# EAGLE design POWER_DISTRO_PiFilter (EAGLE 5.06)
SHT_NAME: POWER INPUT; VOLTAGE: 36V

## Sheet 1 of 4
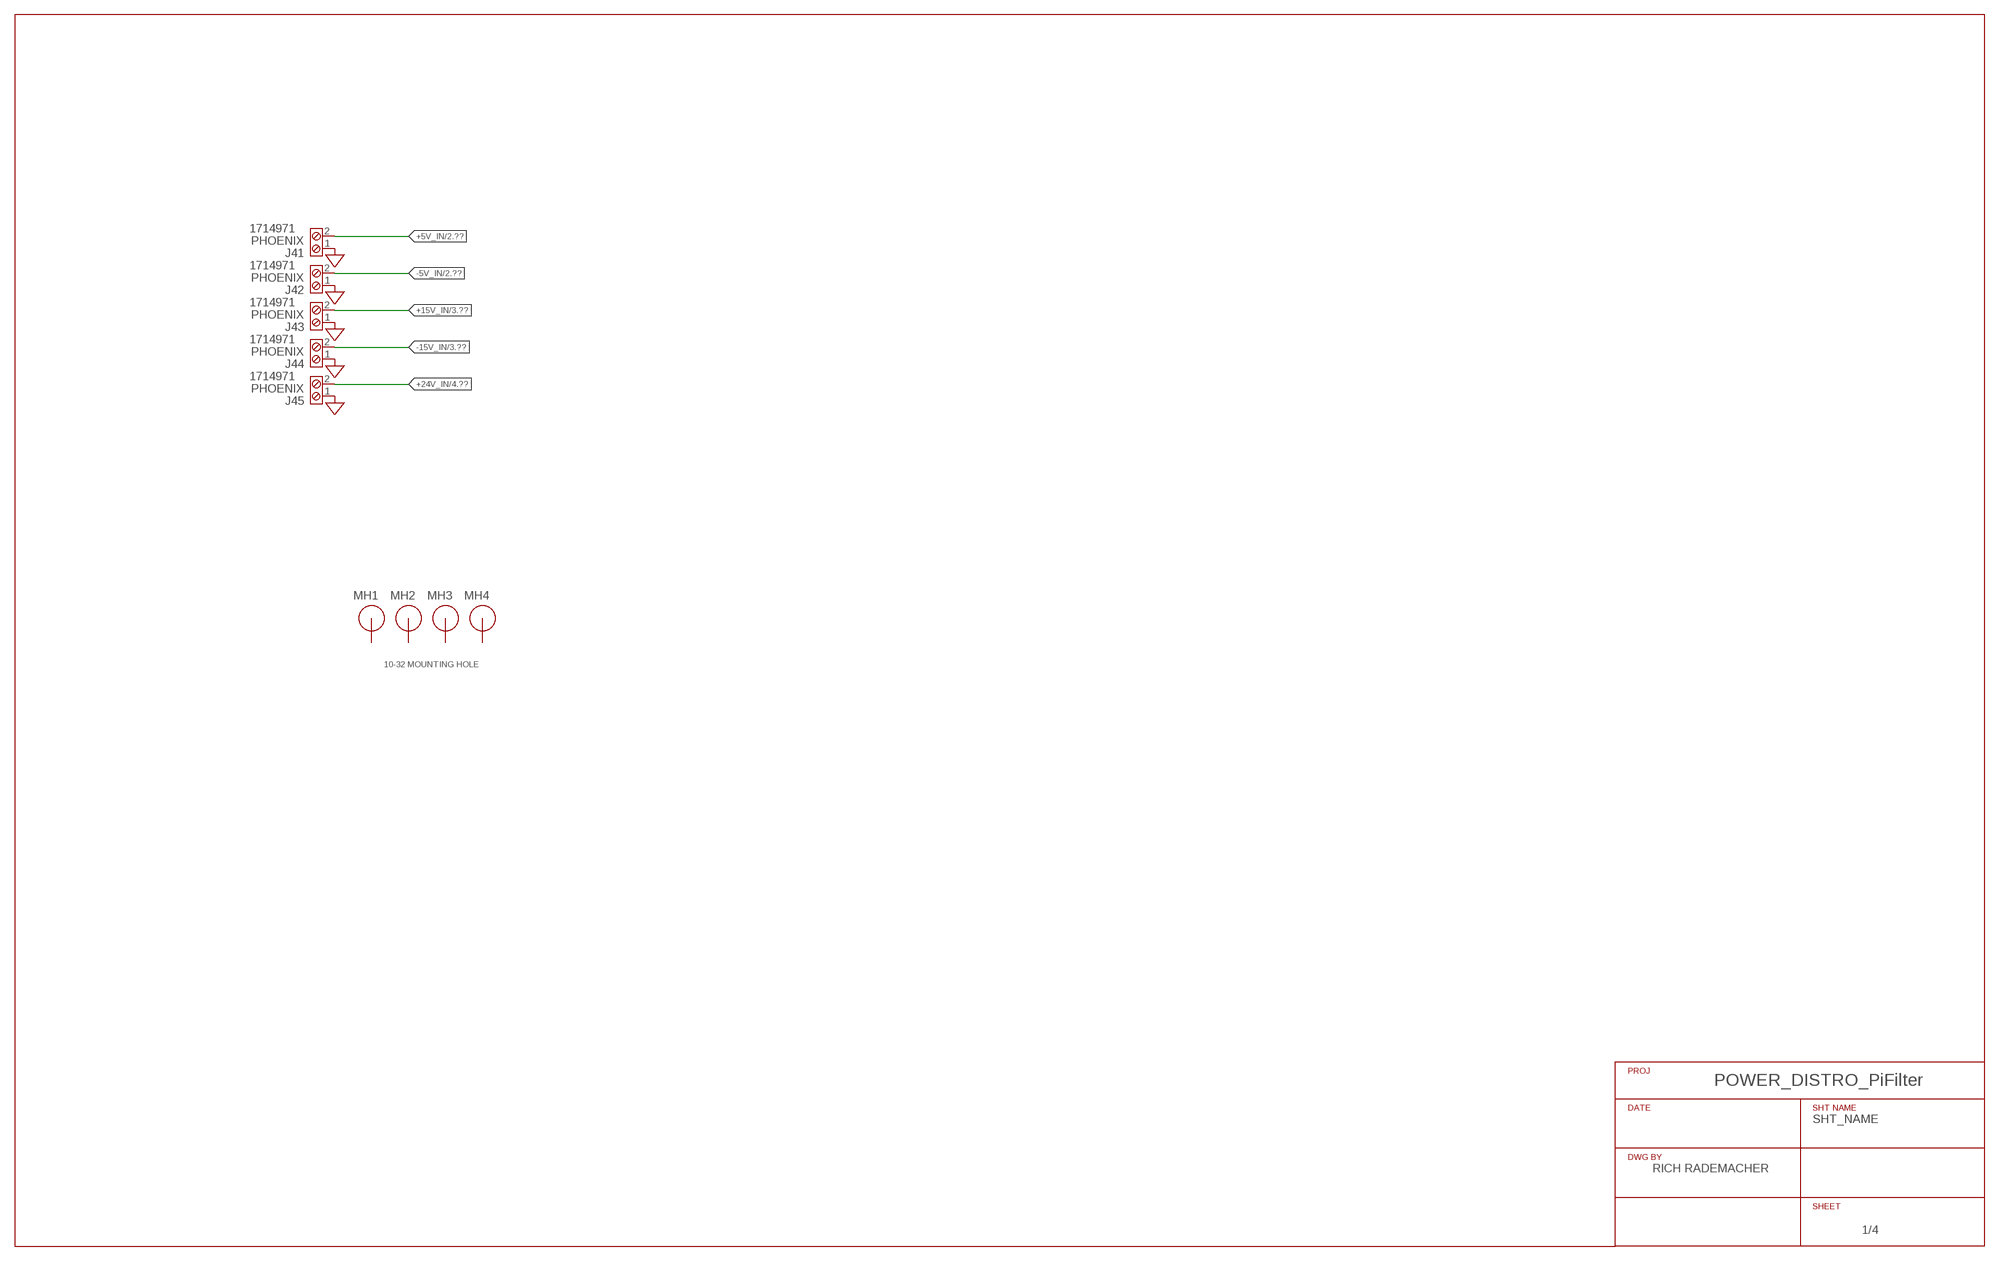
[diagram p0: schematic, sheet 1]
U$4 (TITLEBLOCK): AUTHOR: RICH RADEMACHER; DO_NOT_BOM: TRUE; SHT_NAME: SHT_NAME

### Parts
J41  CONN_SCREWTERM_9.52MM_2POS  [PHOENIX_SCREWTERM_9.52MM_2POS]
J42  CONN_SCREWTERM_9.52MM_2POS  [PHOENIX_SCREWTERM_9.52MM_2POS]
J43  CONN_SCREWTERM_9.52MM_2POS  [PHOENIX_SCREWTERM_9.52MM_2POS]
J44  CONN_SCREWTERM_9.52MM_2POS  [PHOENIX_SCREWTERM_9.52MM_2POS]
J45  CONN_SCREWTERM_9.52MM_2POS  [PHOENIX_SCREWTERM_9.52MM_2POS]
MH1  MTG-HOLE-10-32  [MTG-10-32]
MH2  MTG-HOLE-10-32  [MTG-10-32]
MH3  MTG-HOLE-10-32  [MTG-10-32]
MH4  MTG-HOLE-10-32  [MTG-10-32]

### Nets
+5V_IN: J41.2 ; also sheet 2
+15V_IN: J43.2 ; also sheet 3
+24V_IN: J45.2 ; also sheet 4
-5V_IN: J42.2 ; also sheet 2
-15V_IN: J44.2 ; also sheet 3
AGND: J41.1 J42.1 J43.1 J44.1 J45.1 ; also sheet 2,3,4
Unconnected: MH1.1 MH2.1 MH3.1 MH4.1

### Notes on the sheet
- 10-32 MOUNTING HOLE

## Sheet 2 of 4
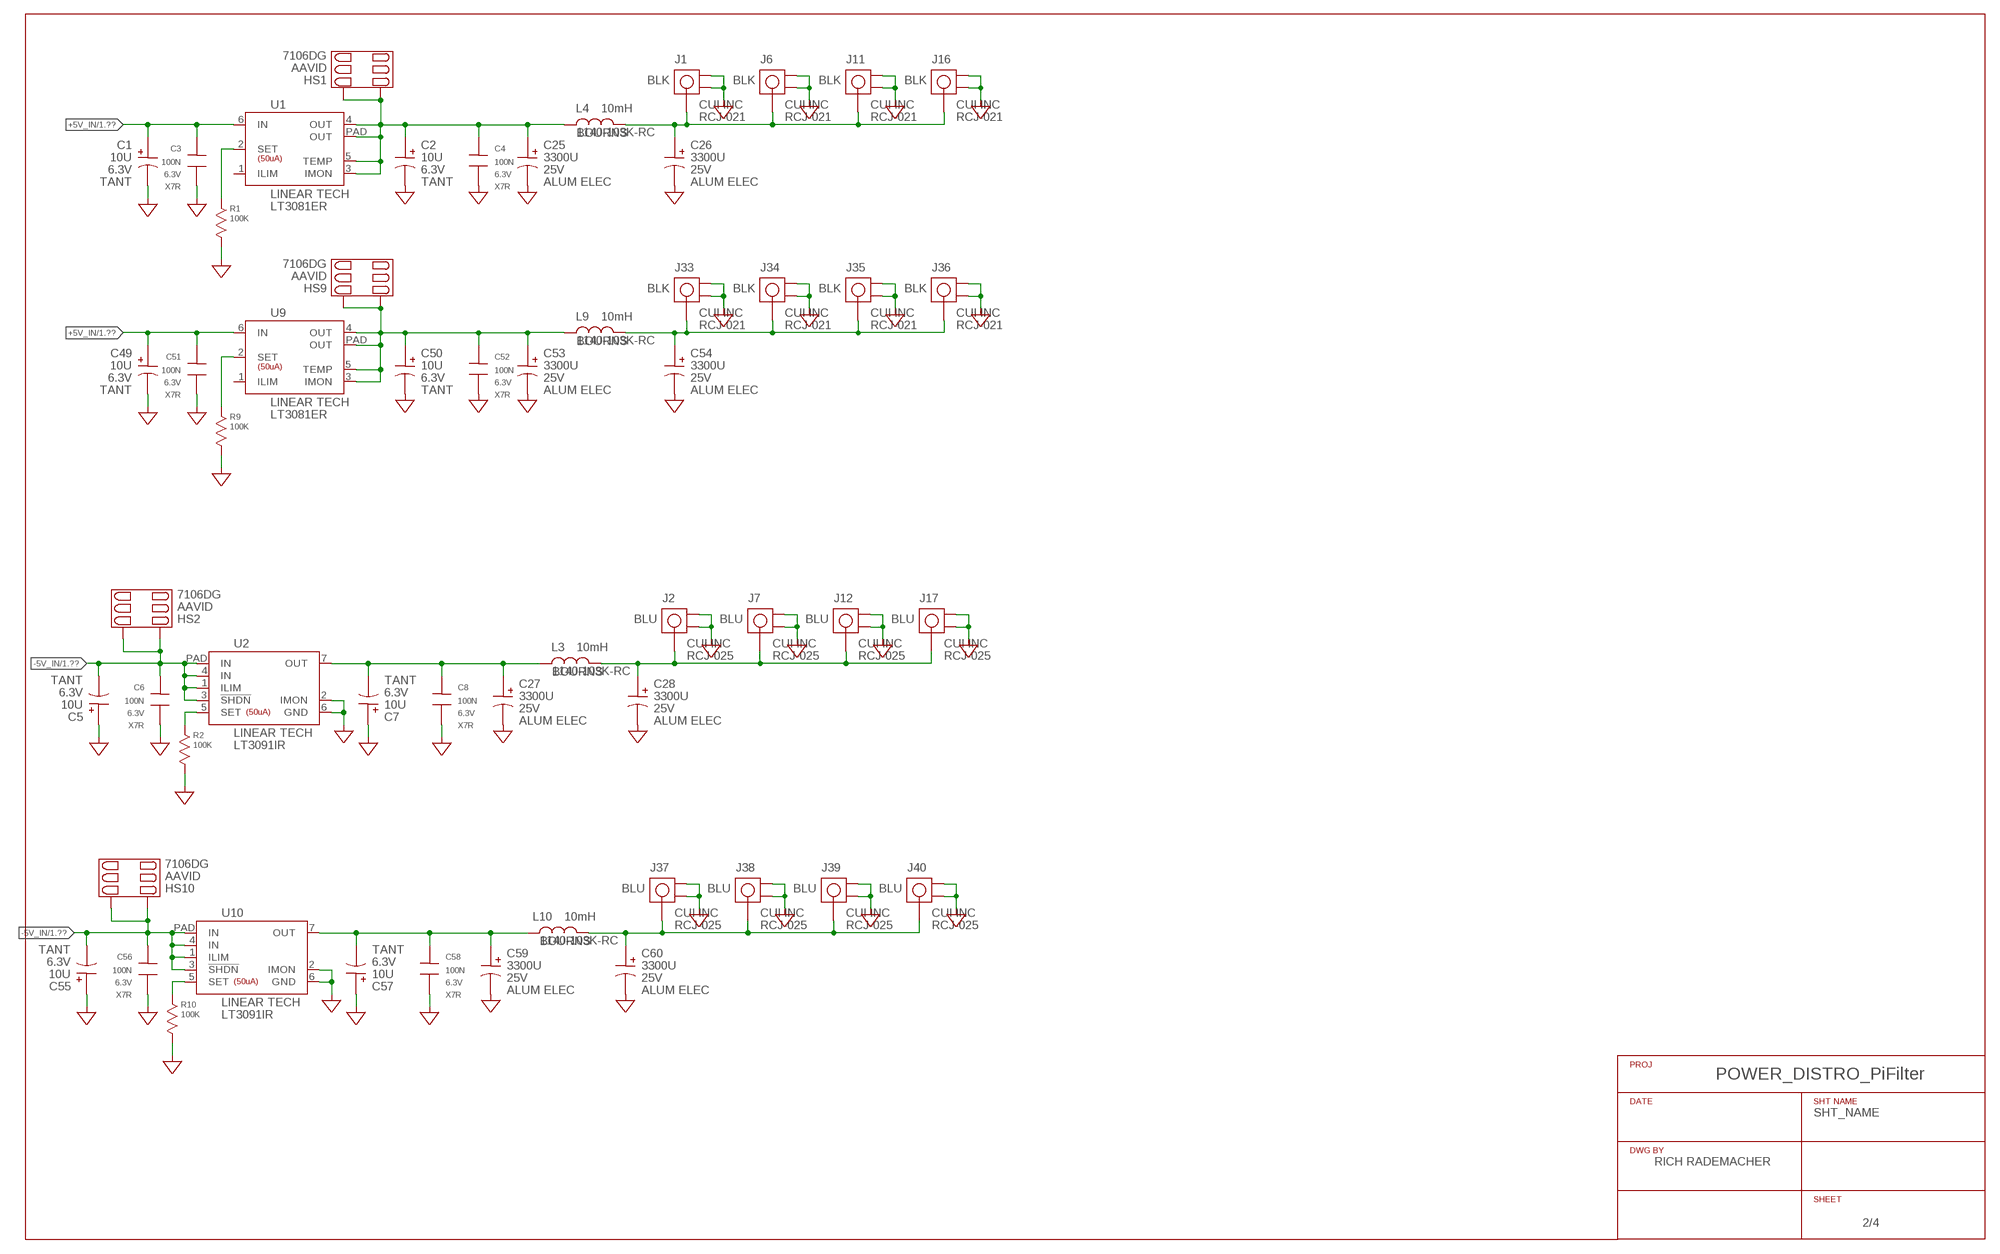
[diagram p1: schematic, sheet 2]
U$1 (TITLEBLOCK): AUTHOR: RICH RADEMACHER; DO_NOT_BOM: TRUE; SHT_NAME: SHT_NAME

### Parts
C1  10U  CAP-POL-SIZED  [CAP-SIZE_D/E_EIA7343]
C2  10U  CAP-POL-SIZED  [CAP-SIZE_D/E_EIA7343]
C3  100N  CAP-NP-0805  [R-0805]
C4  100N  CAP-NP-0805  [R-0805]
C5  10U  CAP-POL-SIZED  [CAP-SIZE_D/E_EIA7343]
C6  100N  CAP-NP-0805  [R-0805]
C7  10U  CAP-POL-SIZED  [CAP-SIZE_D/E_EIA7343]
C8  100N  CAP-NP-0805  [R-0805]
C25  3300U  CAP-POL-18MMDIAM  [CAP-18MM_SMT]
C26  3300U  CAP-POL-18MMDIAM  [CAP-18MM_SMT]
C27  3300U  CAP-POL-18MMDIAM  [CAP-18MM_SMT]
C28  3300U  CAP-POL-18MMDIAM  [CAP-18MM_SMT]
C49  10U  CAP-POL-SIZED  [CAP-SIZE_D/E_EIA7343]
C50  10U  CAP-POL-SIZED  [CAP-SIZE_D/E_EIA7343]
C51  100N  CAP-NP-0805  [R-0805]
C52  100N  CAP-NP-0805  [R-0805]
C53  3300U  CAP-POL-18MMDIAM  [CAP-18MM_SMT]
C54  3300U  CAP-POL-18MMDIAM  [CAP-18MM_SMT]
C55  10U  CAP-POL-SIZED  [CAP-SIZE_D/E_EIA7343]
C56  100N  CAP-NP-0805  [R-0805]
C57  10U  CAP-POL-SIZED  [CAP-SIZE_D/E_EIA7343]
C58  100N  CAP-NP-0805  [R-0805]
C59  3300U  CAP-POL-18MMDIAM  [CAP-18MM_SMT]
C60  3300U  CAP-POL-18MMDIAM  [CAP-18MM_SMT]
HS1  HEATSINK_AAVID_7106  [AAVID_7106]
HS2  HEATSINK_AAVID_7106  [AAVID_7106]
HS9  HEATSINK_AAVID_7106  [AAVID_7106]
HS10  HEATSINK_AAVID_7106  [AAVID_7106]
J1  CONN_RCA  CONN_RCA-BLACK-BLK  [CUI_RCJ-02X]
J2  CONN_RCA  CONN_RCA-BLU-BLK  [CUI_RCJ-02X]
J6  CONN_RCA  CONN_RCA-BLACK-BLK  [CUI_RCJ-02X]
J7  CONN_RCA  CONN_RCA-BLU-BLK  [CUI_RCJ-02X]
J11  CONN_RCA  CONN_RCA-BLACK-BLK  [CUI_RCJ-02X]
J12  CONN_RCA  CONN_RCA-BLU-BLK  [CUI_RCJ-02X]
J16  CONN_RCA  CONN_RCA-BLACK-BLK  [CUI_RCJ-02X]
J17  CONN_RCA  CONN_RCA-BLU-BLK  [CUI_RCJ-02X]
J33  CONN_RCA  CONN_RCA-BLACK-BLK  [CUI_RCJ-02X]
J34  CONN_RCA  CONN_RCA-BLACK-BLK  [CUI_RCJ-02X]
J35  CONN_RCA  CONN_RCA-BLACK-BLK  [CUI_RCJ-02X]
J36  CONN_RCA  CONN_RCA-BLACK-BLK  [CUI_RCJ-02X]
J37  CONN_RCA  CONN_RCA-BLU-BLK  [CUI_RCJ-02X]
J38  CONN_RCA  CONN_RCA-BLU-BLK  [CUI_RCJ-02X]
J39  CONN_RCA  CONN_RCA-BLU-BLK  [CUI_RCJ-02X]
J40  CONN_RCA  CONN_RCA-BLU-BLK  [CUI_RCJ-02X]
L3  10mH  INDUCTOR-BOURNS1040  [BOURNS_1040_INDUCTOR]
L4  10mH  INDUCTOR-BOURNS1040  [BOURNS_1040_INDUCTOR]
L9  10mH  INDUCTOR-BOURNS1040  [BOURNS_1040_INDUCTOR]
L10  10mH  INDUCTOR-BOURNS1040  [BOURNS_1040_INDUCTOR]
R1  100K  RESISTOR-0805  [R-0805]
R2  100K  RESISTOR-0805  [R-0805]
R9  100K  RESISTOR-0805  [R-0805]
R10  100K  RESISTOR-0805  [R-0805]
U1  REG_LT3081  [DD-7_LINEARTECH]
U2  REG_LT3091  [DD-7_LINEARTECH]
U9  REG_LT3081  [DD-7_LINEARTECH]
U10  REG_LT3091  [DD-7_LINEARTECH]

### Nets
+5V: C2.+ C4.1 C25.+ HS1.L HS1.R L4.R U1.3(IMON) U1.4(OUT) U1.5(TEMP) U1.PAD(OUT)
+5V5: C50.+ C52.1 C53.+ HS9.L HS9.R L9.R U9.3(IMON) U9.4(OUT) U9.5(TEMP) U9.PAD(OUT)
+5V_IN: C1.+ C3.1 C49.+ C51.1 U1.6(IN) U9.6(IN) ; also sheet 1
-5V: C28.+ J2.PIN J7.PIN J12.PIN J17.PIN L3.S
-5V3: C60.+ J37.PIN J38.PIN J39.PIN J40.PIN L10.S
-5V_IN: C5.- C6.1 C55.- C56.1 HS2.L HS2.R HS10.L HS10.R U2.1(ILIM) U2.3(!SHDN) U2.4(IN) U2.PAD(IN) U10.1(ILIM) U10.3(!SHDN) U10.4(IN) U10.PAD(IN) ; also sheet 1
AGND: C1.- C2.- C3.2 C4.2 C5.+ C6.2 C7.+ C8.2 C25.- C26.- C27.- C28.- C49.- C50.- C51.2 C52.2 C53.- C54.- C55.+ C56.2 C57.+ C58.2 C59.- C60.- J1.GND@1 J1.GND@2 J2.GND@1 J2.GND@2 J6.GND@1 J6.GND@2 J7.GND@1 J7.GND@2 J11.GND@1 J11.GND@2 J12.GND@1 J12.GND@2 J16.GND@1 J16.GND@2 J17.GND@1 J17.GND@2 J33.GND@1 J33.GND@2 J34.GND@1 J34.GND@2 J35.GND@1 J35.GND@2 J36.GND@1 J36.GND@2 J37.GND@1 J37.GND@2 J38.GND@1 J38.GND@2 J39.GND@1 J39.GND@2 J40.GND@1 J40.GND@2 R1.2 R2.2 R9.2 R10.2 U2.2(IMON) U2.6(GND) U10.2(IMON) U10.6(GND) ; also sheet 1,3,4
N$1: R1.1 U1.2(SET)
N$2: R2.1 U2.5(SET)
N$8: C7.- C8.1 C27.+ L3.R U2.7(OUT)
N$9: C26.+ J1.PIN J6.PIN J11.PIN J16.PIN L4.S
N$10: R9.1 U9.2(SET)
N$18: C54.+ J33.PIN J34.PIN J35.PIN J36.PIN L9.S
N$19: R10.1 U10.5(SET)
N$20: C57.- C58.1 C59.+ L10.R U10.7(OUT)
Unconnected: U1.1(ILIM) U9.1(ILIM)

## Sheet 3 of 4
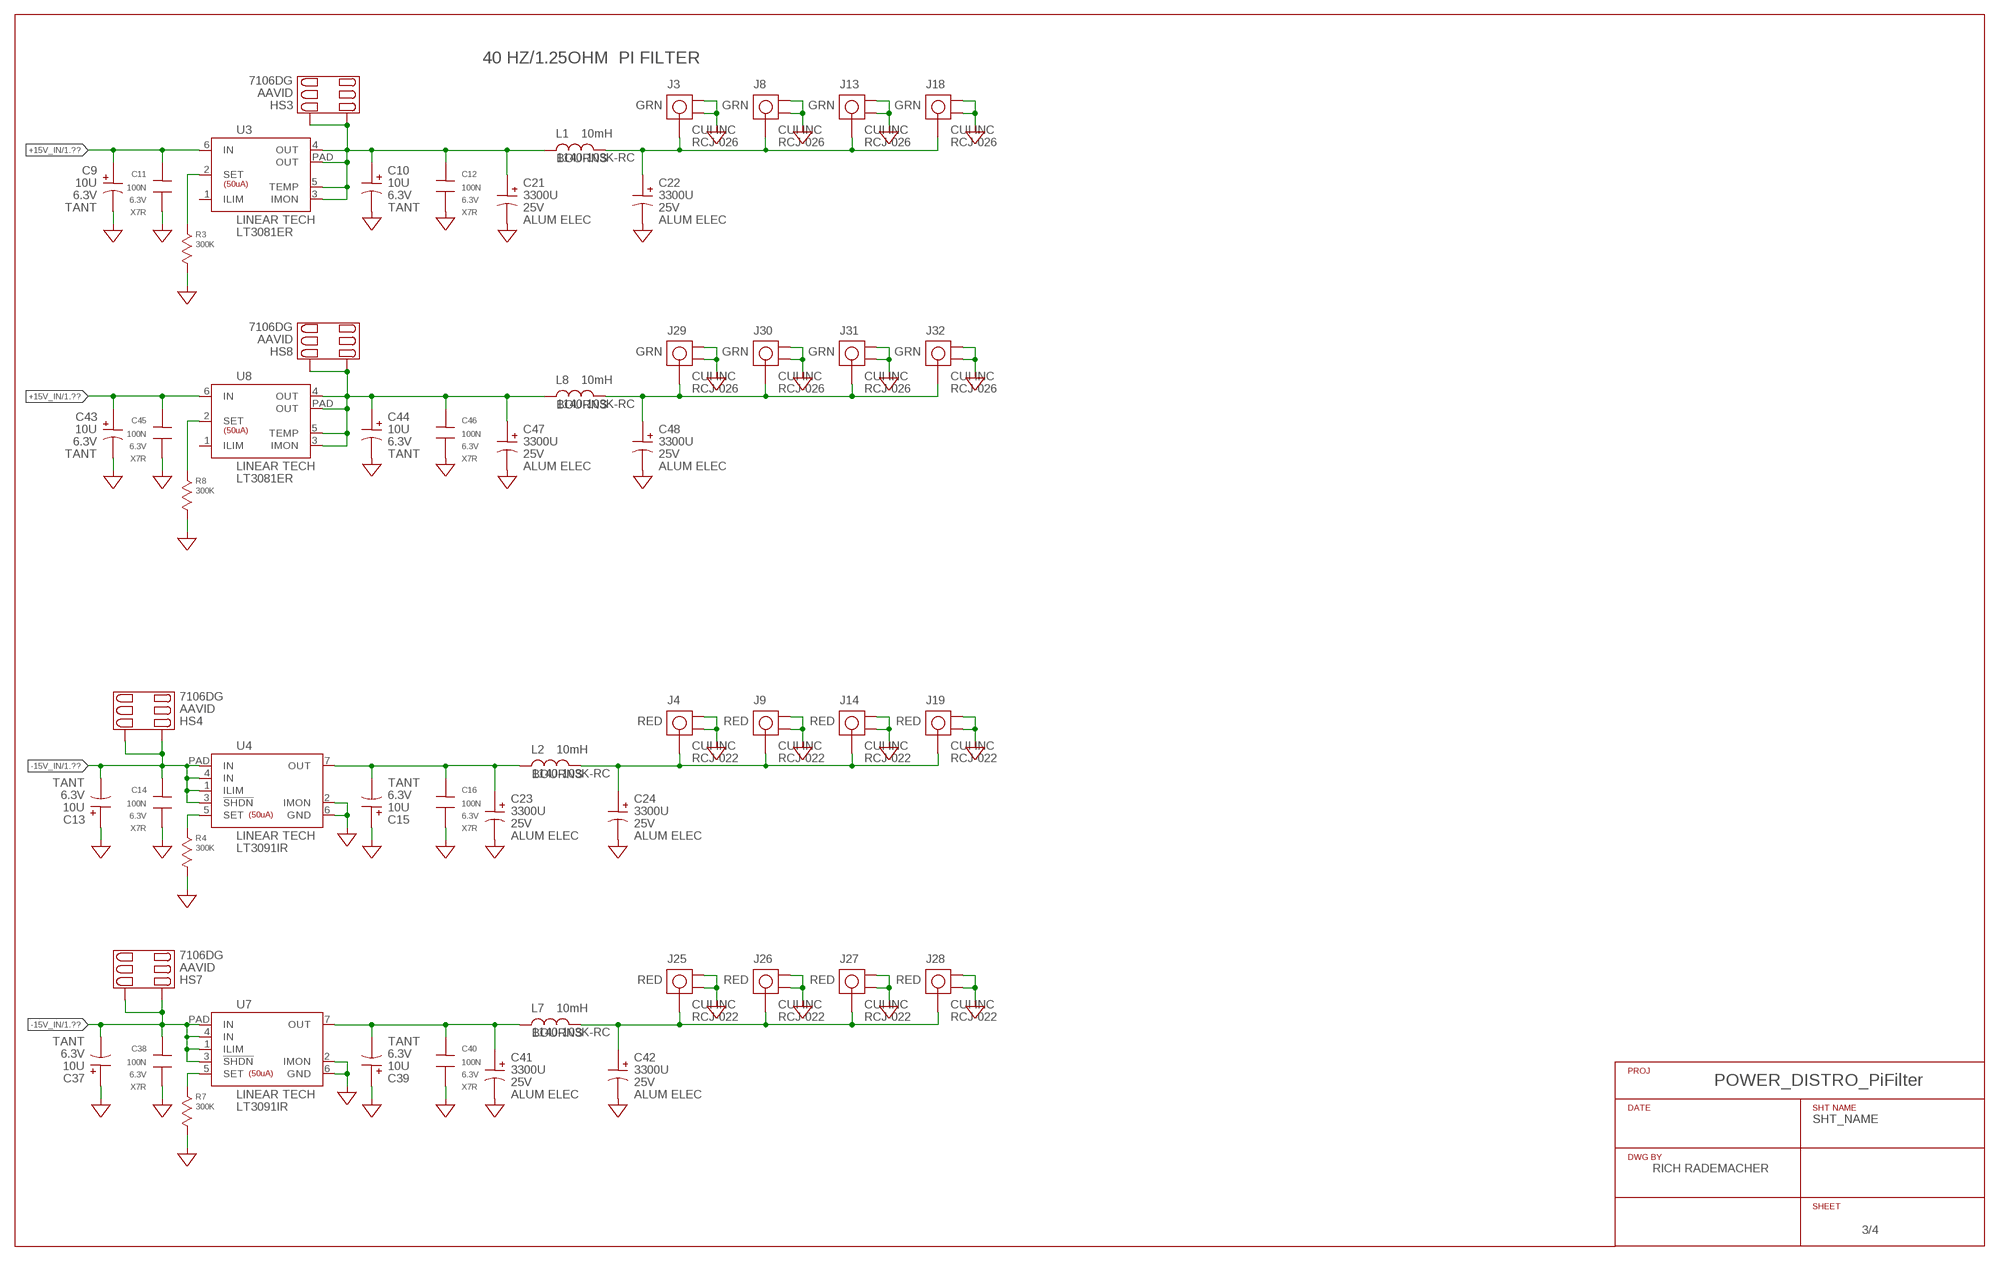
[diagram p2: schematic, sheet 3]
U$2 (TITLEBLOCK): AUTHOR: RICH RADEMACHER; DO_NOT_BOM: TRUE; SHT_NAME: SHT_NAME

### Parts
C9  10U  CAP-POL-SIZED  [CAP-SIZE_D/E_EIA7343]
C10  10U  CAP-POL-SIZED  [CAP-SIZE_D/E_EIA7343]
C11  100N  CAP-NP-0805  [R-0805]
C12  100N  CAP-NP-0805  [R-0805]
C13  10U  CAP-POL-SIZED  [CAP-SIZE_D/E_EIA7343]
C14  100N  CAP-NP-0805  [R-0805]
C15  10U  CAP-POL-SIZED  [CAP-SIZE_D/E_EIA7343]
C16  100N  CAP-NP-0805  [R-0805]
C21  3300U  CAP-POL-18MMDIAM  [CAP-18MM_SMT]
C22  3300U  CAP-POL-18MMDIAM  [CAP-18MM_SMT]
C23  3300U  CAP-POL-18MMDIAM  [CAP-18MM_SMT]
C24  3300U  CAP-POL-18MMDIAM  [CAP-18MM_SMT]
C37  10U  CAP-POL-SIZED  [CAP-SIZE_D/E_EIA7343]
C38  100N  CAP-NP-0805  [R-0805]
C39  10U  CAP-POL-SIZED  [CAP-SIZE_D/E_EIA7343]
C40  100N  CAP-NP-0805  [R-0805]
C41  3300U  CAP-POL-18MMDIAM  [CAP-18MM_SMT]
C42  3300U  CAP-POL-18MMDIAM  [CAP-18MM_SMT]
C43  10U  CAP-POL-SIZED  [CAP-SIZE_D/E_EIA7343]
C44  10U  CAP-POL-SIZED  [CAP-SIZE_D/E_EIA7343]
C45  100N  CAP-NP-0805  [R-0805]
C46  100N  CAP-NP-0805  [R-0805]
C47  3300U  CAP-POL-18MMDIAM  [CAP-18MM_SMT]
C48  3300U  CAP-POL-18MMDIAM  [CAP-18MM_SMT]
HS3  HEATSINK_AAVID_7106  [AAVID_7106]
HS4  HEATSINK_AAVID_7106  [AAVID_7106]
HS7  HEATSINK_AAVID_7106  [AAVID_7106]
HS8  HEATSINK_AAVID_7106  [AAVID_7106]
J3  CONN_RCA  CONN_RCA-GRN-BLK  [CUI_RCJ-02X]
J4  CONN_RCA  CONN_RCA-RED-BLK  [CUI_RCJ-02X]
J8  CONN_RCA  CONN_RCA-GRN-BLK  [CUI_RCJ-02X]
J9  CONN_RCA  CONN_RCA-RED-BLK  [CUI_RCJ-02X]
J13  CONN_RCA  CONN_RCA-GRN-BLK  [CUI_RCJ-02X]
J14  CONN_RCA  CONN_RCA-RED-BLK  [CUI_RCJ-02X]
J18  CONN_RCA  CONN_RCA-GRN-BLK  [CUI_RCJ-02X]
J19  CONN_RCA  CONN_RCA-RED-BLK  [CUI_RCJ-02X]
J25  CONN_RCA  CONN_RCA-RED-BLK  [CUI_RCJ-02X]
J26  CONN_RCA  CONN_RCA-RED-BLK  [CUI_RCJ-02X]
J27  CONN_RCA  CONN_RCA-RED-BLK  [CUI_RCJ-02X]
J28  CONN_RCA  CONN_RCA-RED-BLK  [CUI_RCJ-02X]
J29  CONN_RCA  CONN_RCA-GRN-BLK  [CUI_RCJ-02X]
J30  CONN_RCA  CONN_RCA-GRN-BLK  [CUI_RCJ-02X]
J31  CONN_RCA  CONN_RCA-GRN-BLK  [CUI_RCJ-02X]
J32  CONN_RCA  CONN_RCA-GRN-BLK  [CUI_RCJ-02X]
L1  10mH  INDUCTOR-BOURNS1040  [BOURNS_1040_INDUCTOR]
L2  10mH  INDUCTOR-BOURNS1040  [BOURNS_1040_INDUCTOR]
L7  10mH  INDUCTOR-BOURNS1040  [BOURNS_1040_INDUCTOR]
L8  10mH  INDUCTOR-BOURNS1040  [BOURNS_1040_INDUCTOR]
R3  300K  RESISTOR-0805  [R-0805]
R4  300K  RESISTOR-0805  [R-0805]
R7  300K  RESISTOR-0805  [R-0805]
R8  300K  RESISTOR-0805  [R-0805]
U3  REG_LT3081  [DD-7_LINEARTECH]
U4  REG_LT3091  [DD-7_LINEARTECH]
U7  REG_LT3091  [DD-7_LINEARTECH]
U8  REG_LT3081  [DD-7_LINEARTECH]

### Nets
+5V1: C22.+ J3.PIN J8.PIN J13.PIN J18.PIN L1.S
+5V4: C48.+ J29.PIN J30.PIN J31.PIN J32.PIN L8.S
+15V_IN: C9.+ C11.1 C43.+ C45.1 U3.6(IN) U8.6(IN) ; also sheet 1
-5V1: C24.+ J4.PIN J9.PIN J14.PIN J19.PIN L2.S
-5V2: C42.+ J25.PIN J26.PIN J27.PIN J28.PIN L7.S
-15V_IN: C13.- C14.1 C37.- C38.1 HS4.L HS4.R HS7.L HS7.R U4.1(ILIM) U4.3(!SHDN) U4.4(IN) U4.PAD(IN) U7.1(ILIM) U7.3(!SHDN) U7.4(IN) U7.PAD(IN) ; also sheet 1
AGND: C9.- C10.- C11.2 C12.2 C13.+ C14.2 C15.+ C16.2 C21.- C22.- C23.- C24.- C37.+ C38.2 C39.+ C40.2 C41.- C42.- C43.- C44.- C45.2 C46.2 C47.- C48.- J3.GND@1 J3.GND@2 J4.GND@1 J4.GND@2 J8.GND@1 J8.GND@2 J9.GND@1 J9.GND@2 J13.GND@1 J13.GND@2 J14.GND@1 J14.GND@2 J18.GND@1 J18.GND@2 J19.GND@1 J19.GND@2 J25.GND@1 J25.GND@2 J26.GND@1 J26.GND@2 J27.GND@1 J27.GND@2 J28.GND@1 J28.GND@2 J29.GND@1 J29.GND@2 J30.GND@1 J30.GND@2 J31.GND@1 J31.GND@2 J32.GND@1 J32.GND@2 R3.2 R4.2 R7.2 R8.2 U4.2(IMON) U4.6(GND) U7.2(IMON) U7.6(GND) ; also sheet 1,2,4
N$3: R3.1 U3.2(SET)
N$4: R4.1 U4.5(SET)
N$6: C10.+ C12.1 C21.+ HS3.L HS3.R L1.R U3.3(IMON) U3.4(OUT) U3.5(TEMP) U3.PAD(OUT)
N$7: C15.- C16.1 C23.+ L2.R U4.7(OUT)
N$14: R7.1 U7.5(SET)
N$15: C39.- C40.1 C41.+ L7.R U7.7(OUT)
N$16: R8.1 U8.2(SET)
N$17: C44.+ C46.1 C47.+ HS8.L HS8.R L8.R U8.3(IMON) U8.4(OUT) U8.5(TEMP) U8.PAD(OUT)
Unconnected: U3.1(ILIM) U8.1(ILIM)

### Notes on the sheet
- 40 HZ/1.25OHM  PI FILTER

## Sheet 4 of 4
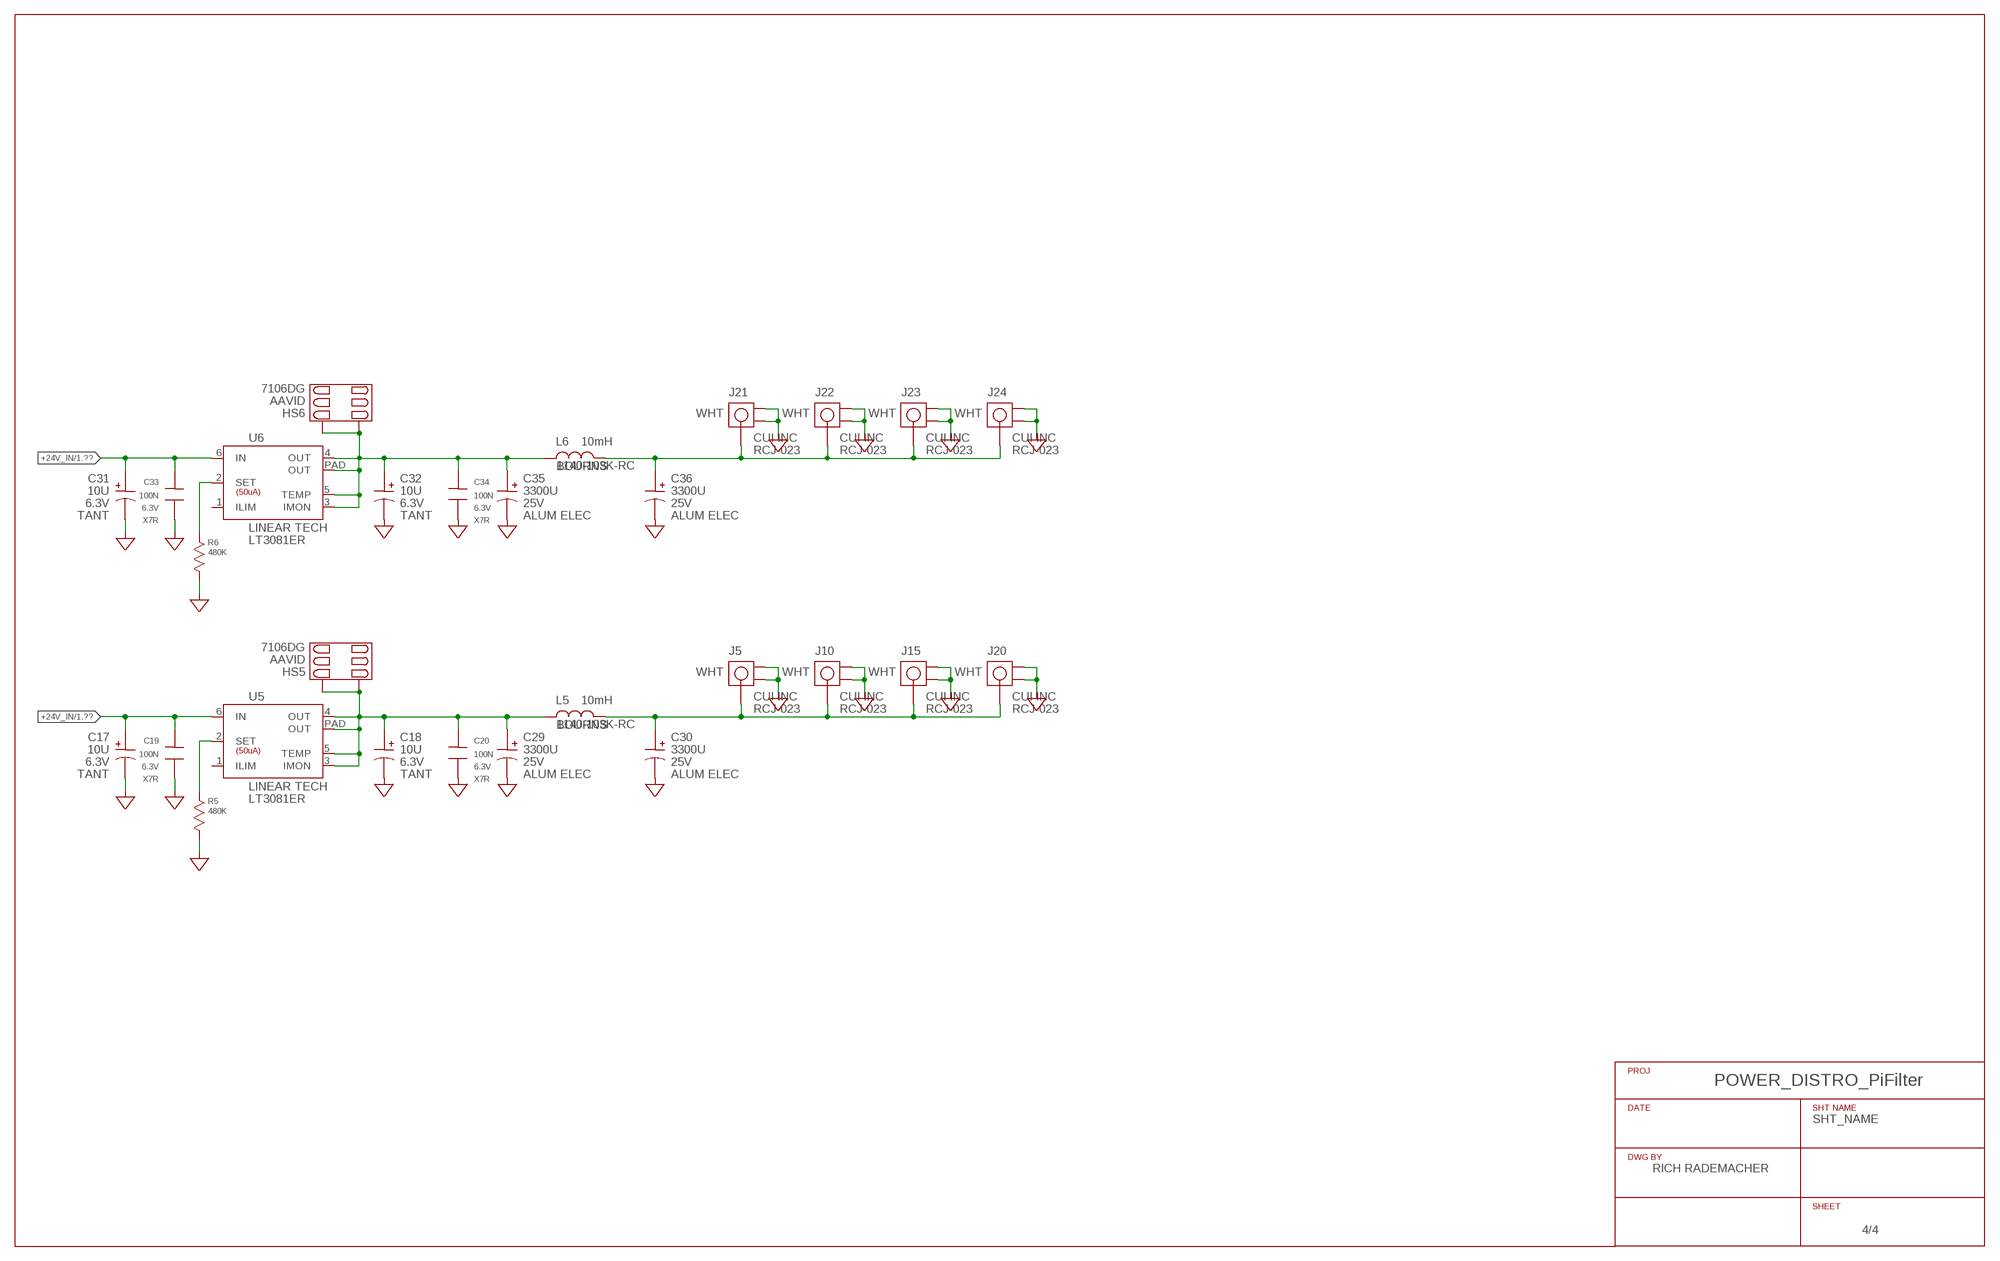
[diagram p3: schematic, sheet 4]
U$3 (TITLEBLOCK): AUTHOR: RICH RADEMACHER; DO_NOT_BOM: TRUE; SHT_NAME: SHT_NAME

### Parts
C17  10U  CAP-POL-SIZED  [CAP-SIZE_D/E_EIA7343]
C18  10U  CAP-POL-SIZED  [CAP-SIZE_D/E_EIA7343]
C19  100N  CAP-NP-0805  [R-0805]
C20  100N  CAP-NP-0805  [R-0805]
C29  3300U  CAP-POL-18MMDIAM  [CAP-18MM_SMT]
C30  3300U  CAP-POL-18MMDIAM  [CAP-18MM_SMT]
C31  10U  CAP-POL-SIZED  [CAP-SIZE_D/E_EIA7343]
C32  10U  CAP-POL-SIZED  [CAP-SIZE_D/E_EIA7343]
C33  100N  CAP-NP-0805  [R-0805]
C34  100N  CAP-NP-0805  [R-0805]
C35  3300U  CAP-POL-18MMDIAM  [CAP-18MM_SMT]
C36  3300U  CAP-POL-18MMDIAM  [CAP-18MM_SMT]
HS5  HEATSINK_AAVID_7106  [AAVID_7106]
HS6  HEATSINK_AAVID_7106  [AAVID_7106]
J5  CONN_RCA  CONN_RCA-WHT-BLK  [CUI_RCJ-02X]
J10  CONN_RCA  CONN_RCA-WHT-BLK  [CUI_RCJ-02X]
J15  CONN_RCA  CONN_RCA-WHT-BLK  [CUI_RCJ-02X]
J20  CONN_RCA  CONN_RCA-WHT-BLK  [CUI_RCJ-02X]
J21  CONN_RCA  CONN_RCA-WHT-BLK  [CUI_RCJ-02X]
J22  CONN_RCA  CONN_RCA-WHT-BLK  [CUI_RCJ-02X]
J23  CONN_RCA  CONN_RCA-WHT-BLK  [CUI_RCJ-02X]
J24  CONN_RCA  CONN_RCA-WHT-BLK  [CUI_RCJ-02X]
L5  10mH  INDUCTOR-BOURNS1040  [BOURNS_1040_INDUCTOR]
L6  10mH  INDUCTOR-BOURNS1040  [BOURNS_1040_INDUCTOR]
R5  480K  RESISTOR-0805  [R-0805]
R6  480K  RESISTOR-0805  [R-0805]
U5  REG_LT3081  [DD-7_LINEARTECH]
U6  REG_LT3081  [DD-7_LINEARTECH]

### Nets
+5V2: C30.+ J5.PIN J10.PIN J15.PIN J20.PIN L5.S
+5V3: C36.+ J21.PIN J22.PIN J23.PIN J24.PIN L6.S
+24V_IN: C17.+ C19.1 C31.+ C33.1 U5.6(IN) U6.6(IN) ; also sheet 1
AGND: C17.- C18.- C19.2 C20.2 C29.- C30.- C31.- C32.- C33.2 C34.2 C35.- C36.- J5.GND@1 J5.GND@2 J10.GND@1 J10.GND@2 J15.GND@1 J15.GND@2 J20.GND@1 J20.GND@2 J21.GND@1 J21.GND@2 J22.GND@1 J22.GND@2 J23.GND@1 J23.GND@2 J24.GND@1 J24.GND@2 R5.2 R6.2 ; also sheet 1,2,3
N$5: R5.1 U5.2(SET)
N$11: R6.1 U6.2(SET)
N$12: C18.+ C20.1 C29.+ HS5.L HS5.R L5.R U5.3(IMON) U5.4(OUT) U5.5(TEMP) U5.PAD(OUT)
N$13: C32.+ C34.1 C35.+ HS6.L HS6.R L6.R U6.3(IMON) U6.4(OUT) U6.5(TEMP) U6.PAD(OUT)
Unconnected: U5.1(ILIM) U6.1(ILIM)

## Library data of the parts
C1 C2 C5 C7 C9 C10 C13 C15 C17 C18 C31 C32 C37 C39 C43 C44 C49 C50 C55 C57 = power_distro:CAP-POL; COST: 1.50; DIELECTRIC: TANT; MFG: AVX; MPN: TAJD-SERIES; SOLIDMODEL: CAP_TANT_SIZE_D.G; VENDOR: DIGIKEY; VOLTAGE: 6.3V
C3 C4 C6 C8 C11 C12 C14 C16 C19 C20 C33 C34 C38 C40 C45 C46 C51 C52 C56 C58 = power_distro:CAP-NP; COST: .074; DIELECTRIC: X7R; SOLIDMODEL: CAP_NP_0805.g; VOLTAGE: 6.3V
C21-C30 C35 C36 C41 C42 C47 C48 C53 C54 C59 C60 = power_distro:CAP-POL; DIELECTRIC: ALUM ELEC; MFG: PANASONIC; MPN: EEV-FK1E332M; PRICE: 2.27; VENDOR: DIGIKEY; VOLTAGE: 25V; VPN: PCE3506CT-ND
HS1-HS10 = power_distro:HEATSINK_AAVID_7106: 7106 Surface mount heat sink for D2 PAK (TO-263), power SO-10 (MO-184) and SO-10 package semiconductors; MFG: AAVID; MPN: 7106DG; PRICE: 1.44; VENDOR: DIGIKEY; VPN: HS412-ND
J1 J6 J11 J16 J33-J36 = power_distro:CONN_RCA: VERTICAL THROUGH HOLE RCA JACK FEMALE; COLOR: BLK; MFG: CUI INC; MPN: RCJ-021; PRICE: 0.88; VENDOR: DIGIKEY; VPN: CP-1406-ND
J2 J7 J12 J17 J37-J40 = power_distro:CONN_RCA: VERTICAL THROUGH HOLE RCA JACK FEMALE; COLOR: BLU; MFG: CUI INC; MPN: RCJ-025; PRICE: 0.88; VENDOR: DIGIKEY; VPN: CP-1410-ND
J3 J8 J13 J18 J29-J32 = power_distro:CONN_RCA: VERTICAL THROUGH HOLE RCA JACK FEMALE; COLOR: GRN; MFG: CUI INC; MPN: RCJ-026; PRICE: 0.88; VENDOR: DIGIKEY; VPN: CP-1411-ND
J4 J9 J14 J19 J25-J28 = power_distro:CONN_RCA: VERTICAL THROUGH HOLE RCA JACK FEMALE; COLOR: RED; MFG: CUI INC; MPN: RCJ-022; PRICE: 0.88; VENDOR: DIGIKEY; VPN: CP-1407-ND
J5 J10 J15 J20-J24 = power_distro:CONN_RCA: VERTICAL THROUGH HOLE RCA JACK FEMALE; COLOR: WHT; MFG: CUI INC; MPN: RCJ-023; PRICE: 0.88; VENDOR: DIGIKEY; VPN: CP-1408-ND
J41-J45 = power_distro:CONN_SCREWTERM_9.52MM_2POS: PC terminal block, Nominal current: 32 A, Nom. voltage: 690 V, Pitch: 9.52 mm, Number of positions: 2, Type of connection: Screw connection, Assembly: Soldering, Conductor/PCB connection direction: 0 °, Color: green; MFG: PHOENIX; MPN: 1714971; PRICE: 1.53; VENDOR: DIGIKEY; VPN: 277-1271-ND
L1-L10 = power_distro:INDUCTOR: 0805HT (2012) Ceramic Chip Inductors Our lowest profile 0805 chip inductors only 0.035" high! Inductance values from 1.8 nH to 150 nH (tolerances as low as 5%) Exceptionally high Q compared to non-wirewound inductors, especially at high frequencies Ceramic construction for highest possible self resonance (up to 11,500 MHz) RoHS Compliant. 260°C compatible. Silver-palladium-platinum-glass frit terminations. COTS Plus tin-silver-copper and tin-lead terminations available Samples of most 5% parts are available in Coilcraft Designer's Kit C321; MFG: BOURNS; MPN: 1140-103K-RC; PRICE: 8.13; VENDOR: DIGIKEY; VPN: M8386-ND
MH1-MH4 = power_distro:MTG-HOLE
R1-R10 = power_distro:RESISTOR; PACKAGE: 0805; PRICE: .059; SOLIDMODEL: res0805.g; TOLERANCE: 1%
U1 U3 U5 U6 U8 U9 = power_distro:REG_LT3081: 1.5A Single Resistor Rugged Linear Regulator with Monitors Extended Safe Operating Area Maximum Output Current: 1.5A Stable with or without Input/Output Capacitors Wide Input Voltage Range: 1.2V to 36V Single Resistor Sets Output Voltage Output Current Monitor: IMON = IOUT/5000 Junction Temperature Monitor: 1µA/°C Output Adjustable to 0V 50µA SET Pin Current: 1% Initial Accuracy Output Voltage Noise: 27µVRMS Parallel Multiple Devices for Higher Current or Heat Spreading Programmable Current Limit Reverse-Battery and Reverse-Current Protection <1mV Load Regulation Typical Independent of VOUT <0.001%/V Line Regulation Typical Available in Thermally-Enhanced 12-Lead 4mm × 4mm DFN and 16-Lead TSSOP, 7-Lead DD-Pak and 7-Lead TO-220; MFG: LINEAR TECH; MPN: LT3081ER; PRICE: 6.25; VENDOR: DIGIKEY; VPN: LT3081ER#PBF-ND
U2 U4 U7 U10 = power_distro:REG_LT3091: ?36V, 1.5A Negative Linear Regulator with Programmable Current Limit Output Current: 1.5A Single Resistor Sets Output Voltage 50µA SET Pin Current: ±1% Initial Accuracy Programmable Current Limit Positive or Negative Output Current Monitor Parallelable for Higher Current and Heat Spreading Low Dropout Voltage: 300mV Low Output Noise: 18µVRMS (10Hz to 100kHz) Configurable as a 3-Terminal Floating Regulator Wide Input Voltage Range: ?1.5V to ?36V Rail-to-Rail Output Voltage Range: 0V to ?32V Positive/Negative Shutdown Logic or UVLO Programmable Cable Drop Compensation Load Regulation: 1.2mV (1mA to 1.5A) Stable with 10µF Minimum Output Capacitor Stable with Ceramic or Tantalum Capacitors Thermally Enhanced 14-Lead 4mm × 3mm DFN, 16-Lead TSSOP, 7-Lead TO-220 and DD Packages; MFG: LINEAR TECH; MPN: LT3091IR; PRICE: 8.12; VENDOR: DIGIKEY; VPN: LT3091IR#PBF-ND

## Board
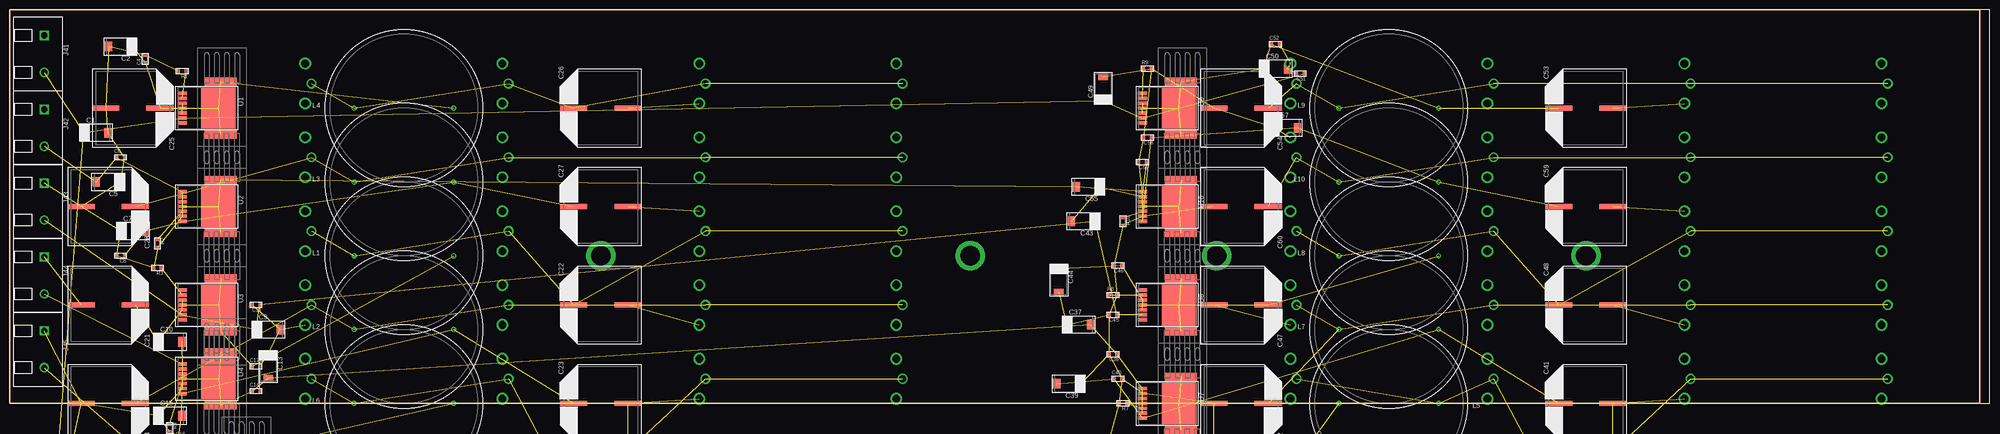
[diagram p4: board, top side]
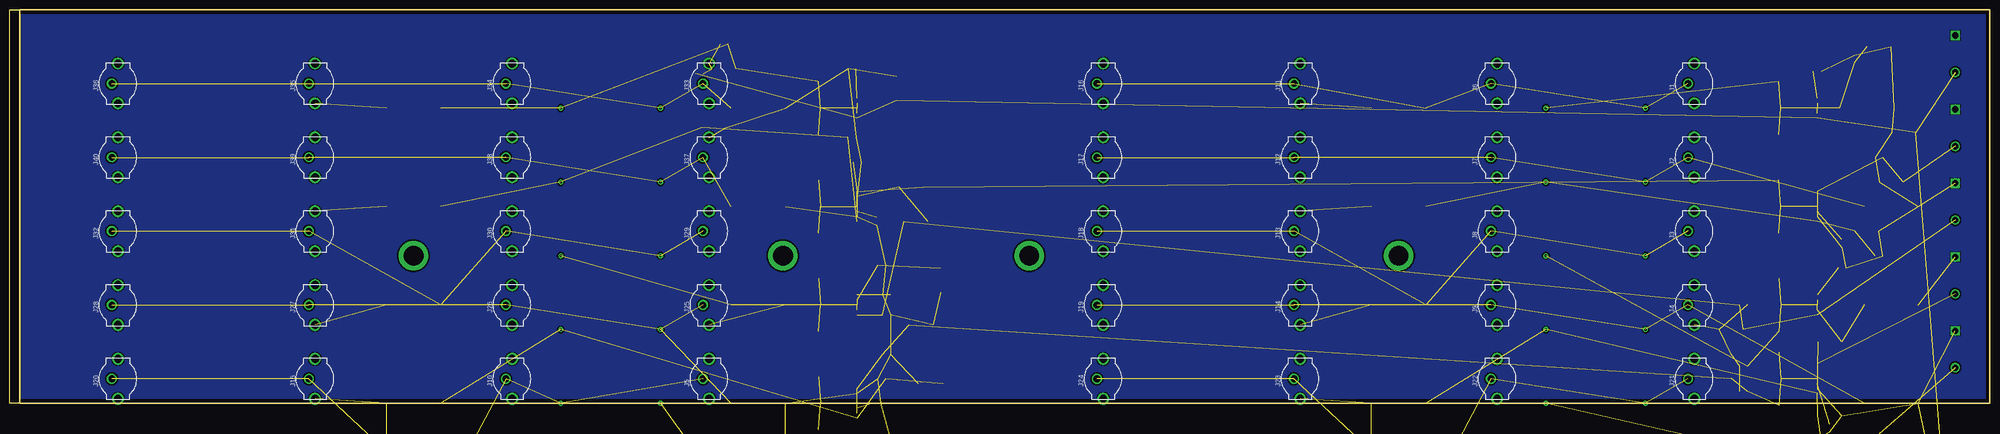
[diagram p5: board, bottom side, seen from below]

Size 510.54 x 101.6 mm. Coordinates in mm from the lower left corner, seen from the top.
Outline: 0,0 510.54,0 510.54,101.6 0,101.6 0,0
Copper layers (1*16): Top 0.035mm / dielectric 1.5mm / Bottom 0.035mm
Design rules "default *": minimum track width 10mil, minimum drill 24mil, track to track 15mil, track to pad 15mil, pad to pad 15mil, via to via 15mil, smd to smd 15mil, copper to edge 40mil, drill to drill 8mil, minimum pad ring 10mil, minimum via ring 8mil, stop-mask expansion 4mil, vias tented up to drill 0mil, thermal gap 10mil
Milling: 4 lines

### Footprints (pad centres in the part's own frame; a part is rotated, then mirrored left to right if it is on the bottom)
CAP-SIZE_D/E_EIA7343 = smd 1.9 x 2.5: + -3.1,0; - 3.1,0
R-0805 = smd 0.762 x 1.27: 1 -1.016,0; 2 1.016,0
CAP-18MM_SMT = smd 1.3 x 7: + 0,7; - 0,-7
AAVID_7106 = smd 2 x 8.2: L -6.825,3.575; R 6.825,3.575
CUI_RCJ-02X = drill 2 round: GND@1 -5.15,0; GND@2 5.15,0 | drill 1.7 round: PIN 0,1.6
PHOENIX_SCREWTERM_9.52MM_2POS = drill 1.6 square: 1 -4.76,0 | drill 1.6 round: 2 4.76,0
BOURNS_1040_INDUCTOR = drill 0.584 pad 1.27 round: R -12.84,0; S 12.84,0
MTG-10-32 = drill 5.105 pad 7.62 round: 1 0,0
DD-7_LINEARTECH = smd 0.889 x 2.286: 1 -3.81,-6.35; 2 -2.54,-6.35; 3 -1.27,-6.35; 4 0,-6.35; 5 1.27,-6.35; 6 2.54,-6.35; 7 3.81,-6.35 | smd 10.668 x 8.89: PAD 0,3.048

### Placement (x,y rotation side)
C1  22.23,69.85 0 top
C2  28.57,92.08 180 top
C3  12.7,-22.23 0 top  (outside the outline)
C4  34.92,88.9 90 top
C5  25.4,57.15 180 top
C6  28.57,63.5 0 top
C7  31.75,44.45 0 top
C8  28.57,38.1 180 top
C9  66.67,19.05 0 top
C10  41.27,15.88 0 top
C11  63.5,25.4 180 top
C12  63.5,9.53 0 top
C13  66.67,9.53 270 top
C14  63.5,3.17 0 top
C15  41.27,-3.17 0 top  (outside the outline)
C16  44.45,-9.53 0 top  (outside the outline)
C17  279.4,-12.7 0 top  (outside the outline)
C18  279.4,-38.1 180 top  (outside the outline)
C19  279.4,-25.4 270 top  (outside the outline)
C20  279.4,-44.45 180 top  (outside the outline)
C21  25.4,25.4 270 top
C22  152.4,25.4 90 top
C23  152.4,0 90 top
C24  25.4,0 270 top
C25  31.75,76.2 270 top
C26  152.4,76.2 90 top
C27  152.4,50.8 90 top
C28  25.4,50.8 270 top
C29  317.5,-25.4 270 top  (outside the outline)
C30  406.4,-25.4 90 top  (outside the outline)
C31  44.45,-19.05 0 top  (outside the outline)
C32  44.45,-38.1 0 top  (outside the outline)
C33  44.45,-25.4 0 top  (outside the outline)
C34  44.45,-44.45 0 top  (outside the outline)
C35  25.4,-25.4 270 top  (outside the outline)
C36  152.4,-25.4 90 top  (outside the outline)
C37  275.59,20.32 0 top
C38  284.48,12.7 180 top
C39  273.05,5.08 180 top
C40  285.75,6.35 0 top
C41  406.4,0 90 top
C42  317.5,0 270 top
C43  276.86,46.99 180 top
C44  270.51,31.75 270 top
C45  284.48,22.86 180 top
C46  285.75,35.56 180 top
C47  317.5,25.4 270 top
C48  406.4,25.4 90 top
C49  281.94,81.28 90 top
C50  326.39,86.36 0 top
C51  332.74,85.09 180 top
C52  326.39,92.71 0 top
C53  406.4,76.2 90 top
C54  317.5,76.2 270 top
C55  278.13,55.88 180 top
C56  292.1,62.23 180 top
C57  328.93,71.12 0 top
C58  293.37,68.58 180 top
C59  406.4,50.8 90 top
C60  317.5,50.8 270 top
HS1  50.8,76.2 270 top
HS2  50.8,50.8 270 top
HS3  50.8,25.4 270 top
HS4  50.8,6.35 270 top
HS5  292.1,-25.4 270 top  (outside the outline)
HS6  57.15,-19.05 270 top  (outside the outline)
HS7  298.45,0 270 top
HS8  298.45,25.4 270 top
HS9  298.45,76.2 270 top
HS10  298.45,50.8 270 top
J1  76.2,82.55 90 bottom
J2  76.2,63.5 90 bottom
J3  76.2,44.45 90 bottom
J4  76.2,25.4 90 bottom
J5  330.2,6.35 90 bottom
J6  127,82.55 90 bottom
J7  127,63.5 90 bottom
J8  127,44.45 90 bottom
J9  127,25.4 90 bottom
J10  381,6.35 90 bottom
J11  177.8,82.55 90 bottom
J12  177.8,63.5 90 bottom
J13  177.8,44.45 90 bottom
J14  177.8,25.4 90 bottom
J15  431.8,6.35 90 bottom
J16  228.6,82.55 90 bottom
J17  228.6,63.5 90 bottom
J18  228.6,44.45 90 bottom
J19  228.6,25.4 90 bottom
J20  482.6,6.35 90 bottom
J21  76.2,6.35 90 bottom
J22  127,6.35 90 bottom
J23  177.8,6.35 90 bottom
J24  228.6,6.35 90 bottom
J25  330.2,25.4 90 bottom
J26  381,25.4 90 bottom
J27  431.8,25.4 90 bottom
J28  482.6,25.4 90 bottom
J29  330.2,44.45 90 bottom
J30  381,44.45 90 bottom
J31  431.8,44.45 90 bottom
J32  482.6,44.45 90 bottom
J33  330.2,82.55 90 bottom
J34  381,82.55 90 bottom
J35  431.8,82.55 90 bottom
J36  482.6,82.55 90 bottom
J37  330.2,63.5 90 bottom
J38  381,63.5 90 bottom
J39  431.8,63.5 90 bottom
J40  482.6,63.5 90 bottom
J41  8.89,90.17 270 top
J42  8.89,71.12 270 top
J43  8.89,52.07 270 top
J44  8.89,33.02 270 top
J45  8.89,13.97 270 top
L1  101.6,38.1 180 top
L2  101.6,19.05 180 top
L3  101.6,57.15 180 top
L4  101.6,76.2 180 top
L5  355.6,0 0 top
L6  101.6,0 180 top
L7  355.6,19.05 180 top
L8  355.6,38.1 180 top
L9  355.6,76.2 180 top
L10  355.6,57.15 180 top
MH1  152.4,38.1 0 top
MH2  311.15,38.1 0 top
MH3  406.4,38.1 0 top
MH4  247.65,38.1 0 top
R1  44.45,85.72 180 top
R2  38.1,41.27 270 top
R3  38.1,34.92 180 top
R4  41.27,-6.35 270 top  (outside the outline)
R5  279.4,-19.05 90 top  (outside the outline)
R6  50.8,-31.75 90 top  (outside the outline)
R7  287.02,0 180 top
R8  284.48,27.94 0 top
R9  293.37,86.36 0 top
R10  287.02,46.99 270 top
U1  50.8,76.2 270 top
U2  50.8,50.8 270 top
U3  50.8,25.4 270 top
U4  50.8,6.35 270 top
U5  292.1,-25.4 270 top  (outside the outline)
U6  57.15,-19.05 270 top  (outside the outline)
U7  298.45,0 270 top
U8  298.45,25.4 270 top
U9  298.45,76.2 270 top
U10  298.45,50.8 270 top

### Tracks (layer width: path | path; a pad name or v marks a point on that pad's centre or on a via)
+5V  (9 unrouted)
+5V1  (5 unrouted)
+5V2  (5 unrouted)
+5V3  (5 unrouted)
+5V4  (5 unrouted)
+5V5  (9 unrouted)
+5V_IN  (6 unrouted)
+15V_IN  (6 unrouted)
+24V_IN  (6 unrouted)
-5V  (5 unrouted)
-5V1  (5 unrouted)
-5V2  (5 unrouted)
-5V3  (5 unrouted)
-5V_IN  (16 unrouted)
-15V_IN  (16 unrouted)
AGND  (78 unrouted)
  pour Bottom: 0,101.6 508,101.6 508,0 0,0
N$1  (1 unrouted)
N$2  (1 unrouted)
N$3  (1 unrouted)
N$4  (1 unrouted)
N$5  (1 unrouted)
N$6  (9 unrouted)
N$7  (4 unrouted)
N$8  (4 unrouted)
N$9  (5 unrouted)
N$10  (1 unrouted)
N$11  (1 unrouted)
N$12  (9 unrouted)
N$13  (9 unrouted)
N$14  (1 unrouted)
N$15  (4 unrouted)
N$16  (1 unrouted)
N$17  (9 unrouted)
N$18  (5 unrouted)
N$19  (1 unrouted)
N$20  (4 unrouted)